# Altium schematic sheet 3.SchDoc
size A
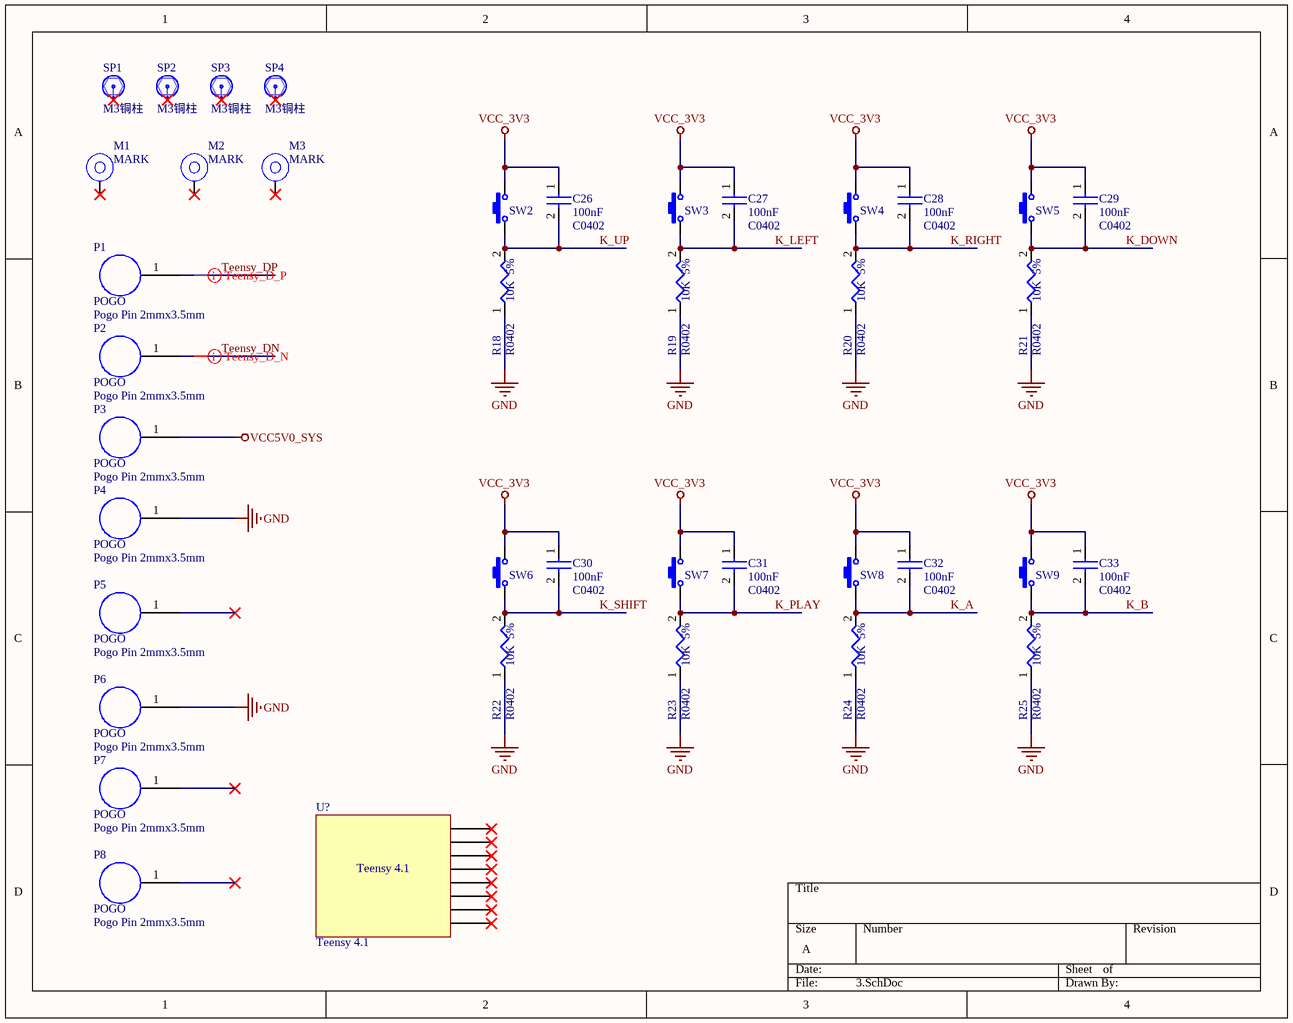
[diagram p0: 3.SchDoc]

## Parts
C26  100nF  PCB Footprint: C0402  [C0402_L]
C27  100nF  PCB Footprint: C0402  [C0402_L]
C28  100nF  PCB Footprint: C0402  [C0402_L]
C29  100nF  PCB Footprint: C0402  [C0402_L]
C30  100nF  PCB Footprint: C0402  [C0402_L]
C31  100nF  PCB Footprint: C0402  [C0402_L]
C32  100nF  PCB Footprint: C0402  [C0402_L]
C33  100nF  PCB Footprint: C0402  [C0402_L]
M1  MARK  [MARK]  (net tie, no BOM)
M2  MARK  [MARK]  (net tie, no BOM)
M3  MARK  [MARK]  (net tie, no BOM)
P1  Pogo Pin 2mmx3.5mm  [Pogo_2x3.5]
P2  Pogo Pin 2mmx3.5mm  [Pogo_2x3.5]
P3  Pogo Pin 2mmx3.5mm  [Pogo_2x3.5]
P4  Pogo Pin 2mmx3.5mm  [Pogo_2x3.5]
P5  Pogo Pin 2mmx3.5mm  [Pogo_2x3.5]
P6  Pogo Pin 2mmx3.5mm  [Pogo_2x3.5]
P7  Pogo Pin 2mmx3.5mm  [Pogo_2x3.5]
P8  Pogo Pin 2mmx3.5mm  [Pogo_2x3.5]
R18  10K  Tolerance: 5%  [R0402]
R19  10K  Tolerance: 5%  [R0402]
R20  10K  Tolerance: 5%  [R0402]
R21  10K  Tolerance: 5%  [R0402]
R22  10K  Tolerance: 5%  [R0402]
R23  10K  Tolerance: 5%  [R0402]
R24  10K  Tolerance: 5%  [R0402]
R25  10K  Tolerance: 5%  [R0402]
SP1  M3铜柱  [M3x4_N]  (net tie, no BOM)
SP2  M3铜柱  [M3x4_N]  (net tie, no BOM)
SP3  M3铜柱  [M3x4_N]  (net tie, no BOM)
SP4  M3铜柱  [M3x4_N]  (net tie, no BOM)
SW2  3x6x5  [Kailh_socket_PG1350]  (value not drawn)
SW3  3x6x5  [Kailh_socket_PG1350]  (value not drawn)
SW4  3x6x5  [Kailh_socket_PG1350]  (value not drawn)
SW5  3x6x5  [Kailh_socket_PG1350]  (value not drawn)
SW6  3x6x5  [Kailh_socket_PG1350]  (value not drawn)
SW7  3x6x5  [Kailh_socket_PG1350]  (value not drawn)
SW8  3x6x5  [Kailh_socket_PG1350]  (value not drawn)
SW9  3x6x5  [Kailh_socket_PG1350]  (value not drawn)
U?  Teensy 4.1  [Teensy_Mech]  (net tie)

## Nets
GND: P4.1 P6.1 R18.1 R19.1 R20.1 R21.1 R22.1 R23.1 R24.1 R25.1
VCC5V0_SYS: P3.1
VCC_3V3: C26.1 C27.1 C28.1 C29.1 C30.1 C31.1 C32.1 C33.1 SW2.2 SW3.2 SW4.2 SW5.2 SW6.2 SW7.2 SW8.2 SW9.2
K_A: C32.2 R24.2 SW8.1
K_B: C33.2 R25.2 SW9.1
K_DOWN: C29.2 R21.2 SW5.1
K_LEFT: C27.2 R19.2 SW3.1
K_PLAY: C31.2 R23.2 SW7.1
K_RIGHT: C28.2 R20.2 SW4.1
K_SHIFT: C30.2 R22.2 SW6.1
K_UP: C26.2 R18.2 SW2.1
Teensy_DN: P2.1
Teensy_DP: P1.1

Not connected (* = marked no-connect by the designer): M1 1*; M2 1*; M3 1*; P5 1*; P7 1*; P8 1*; SP1 1*; SP2 1*; SP3 1*; SP4 1*; U? ?1* ?2* ?3* ?4* ?5* ?6* ?7* ?8*

## Layout directives
differential pair; differential pair class USB; net class USB: Teensy_DN, Teensy_DP

## Notes on the sheet
- (in symbol Pogo Pin) POGO

## Library data of the parts
C26-C33 = CAP NP_Dup1: cap,100.00nF,+/-10%,10V,X5R,C0402; Manufacturer_Name: Open/Any; Priority: A; Part Type: Capacitor; Package: 0402; Manufacturer_Part_Number: Open/Any
M1-M3 = MARK: PCBA MARKS; Part Type: Mechnical
P1-P8 = Pogo Pin
R18-R25 = RESISTOR: 通用厚膜电阻,10K,+/-5%,R0402; Manufacturer_Name: Open/Any; Priority: A; PCB Footprint: R0402; Part Type: Resistor; Package: 0402; Manufacturer_Part_Number: Open/Any
SP1-SP4 = 铜柱大焊盘: 铜柱; Part Type: Mount Hole
SW2-SW9 = SW-PB: 微动开关; BOM名称: 3x6轻触开关; 联系卖家，免费查找封装: 唯一出售店铺网址https://shop463601444.taobao.com; 封装库来自淘宝卖家ID：黄晶宝石: 其他店铺购入均为盗版假冒封装库，请立即申请退款